# Altium schematic sheet Schematic_MC.SchDoc
size A2; SheetNumber: 1; SheetTotal: 1
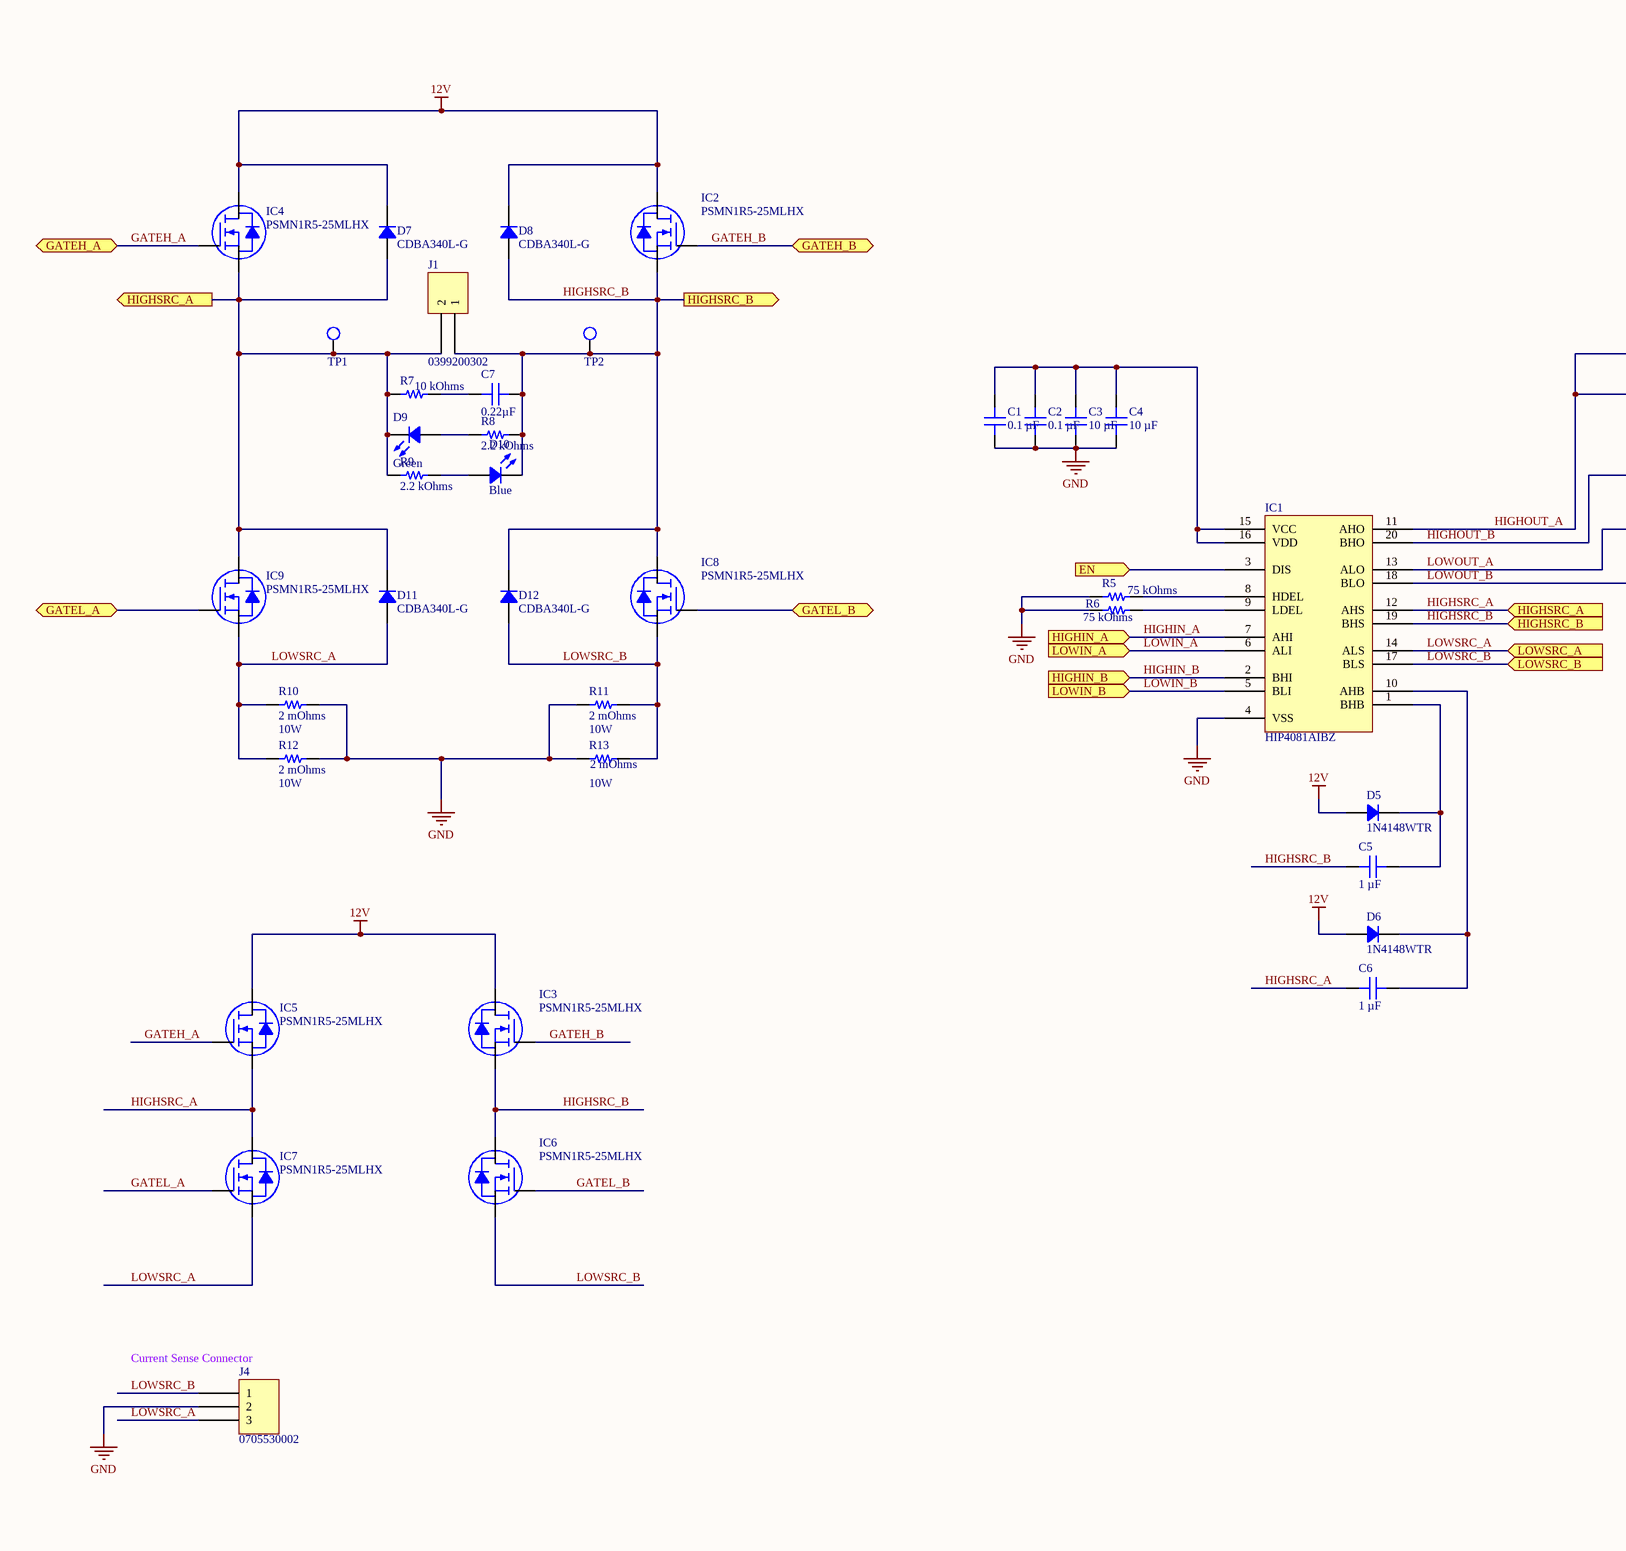
[diagram p0: Schematic_MC.SchDoc, left]
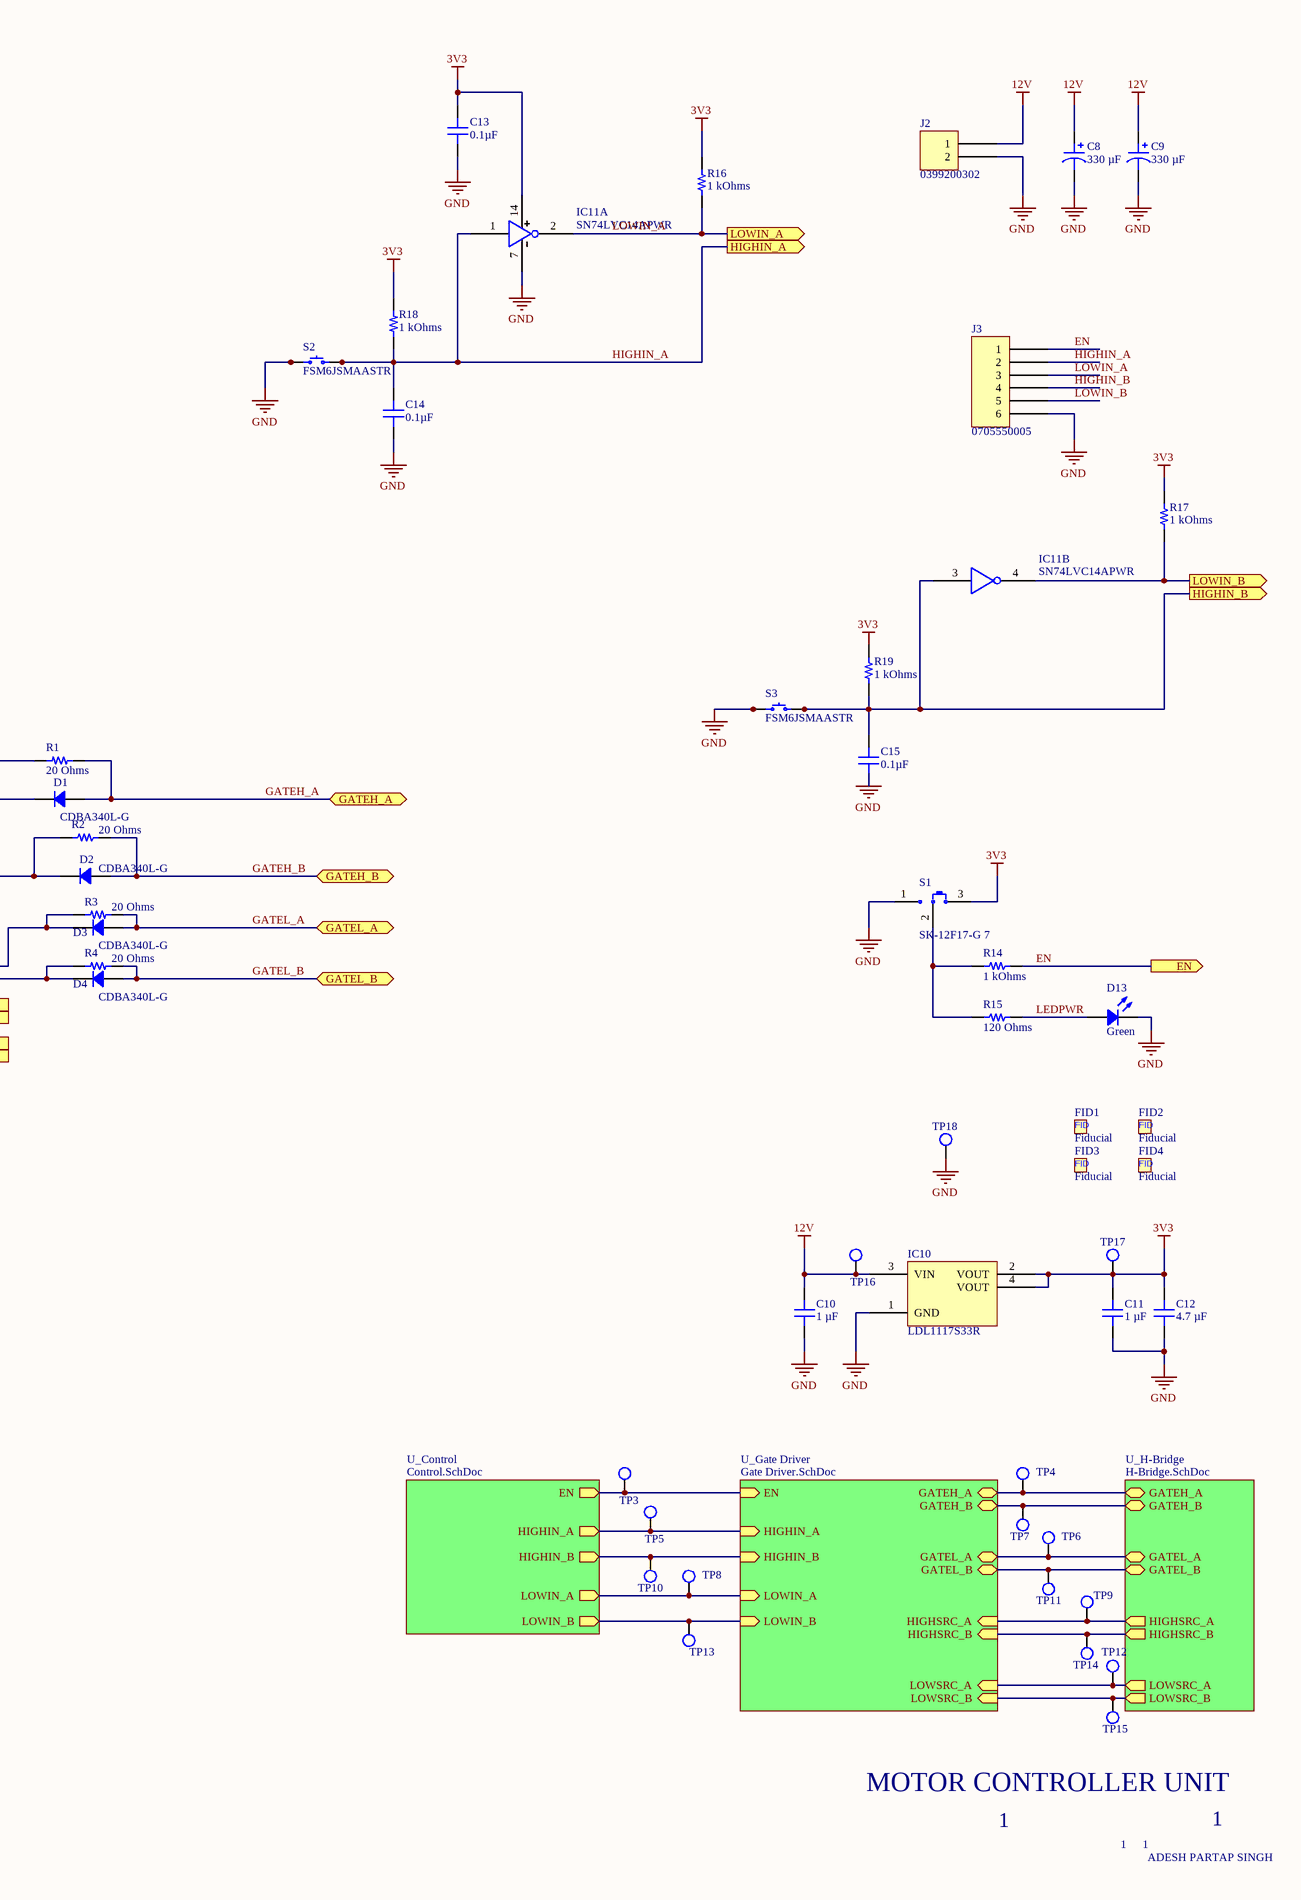
[diagram p1: Schematic_MC.SchDoc, right]

## Parts
C1  0.1 µF  [CAP 0603_1608]
C2  0.1 µF  [CAP 0603_1608]
C3  10 µF  [CAP 1206_3216 - 0.8MM]
C4  10 µF  [CAP 1206_3216 - 0.8MM]
C5  1 µF  [CAP 0805_2012]
C6  1 µF  [CAP 0805_2012]
C7  0.22µF  [CAP 0805_2012]
C8  330 µF  [CAP TH ALPOLY D10.00mm S5.00mm H13.50mm]
C9  330 µF  [CAP TH ALPOLY D10.00mm S5.00mm H13.50mm]
C10  1 µF  [CAP 0805_2012]
C11  1 µF  [CAP 0805_2012]
C12  4.7 µF  [CAP 0805_2012]
C13  0.1µF  [CAP 0603_1608]
C14  0.1µF  [CAP 0603_1608]
C15  0.1µF  [CAP 0603_1608]
D1  CDBA340L-G  [DO214AC SMA]
D2  CDBA340L-G  [DO214AC SMA]
D3  CDBA340L-G  [DO214AC SMA]
D4  CDBA340L-G  [DO214AC SMA]
D5  1N4148WTR  [SOD-123]
D6  1N4148WTR  [SOD-123]
D7  CDBA340L-G  [DO214AC SMA]
D8  CDBA340L-G  [DO214AC SMA]
D9  Green  [LED 0603_1608 GREEN]
D10  Blue  [LED 0603_1608 BLUE]
D11  CDBA340L-G  [DO214AC SMA]
D12  CDBA340L-G  [DO214AC SMA]
D13  Green  [LED 0603_1608 GREEN]
FID1  Fiducial  [Fiducial-1mm]
FID2  Fiducial  [Fiducial-1mm]
FID3  Fiducial  [Fiducial-1mm]
FID4  Fiducial  [Fiducial-1mm]
IC1  HIP4081AIBZ  [INTERSIL SOIC-20 WIDE]
IC2  PSMN1R5-25MLHX  [NEXPERIA LFPAK33 SOT1210]
IC3  PSMN1R5-25MLHX  [NEXPERIA LFPAK33 SOT1210]
IC4  PSMN1R5-25MLHX  [NEXPERIA LFPAK33 SOT1210]
IC5  PSMN1R5-25MLHX  [NEXPERIA LFPAK33 SOT1210]
IC6  PSMN1R5-25MLHX  [NEXPERIA LFPAK33 SOT1210]
IC7  PSMN1R5-25MLHX  [NEXPERIA LFPAK33 SOT1210]
IC8  PSMN1R5-25MLHX  [NEXPERIA LFPAK33 SOT1210]
IC9  PSMN1R5-25MLHX  [NEXPERIA LFPAK33 SOT1210]
IC10  LDL1117S33R  [ST SOT-223]
IC11  SN74LVC14APWR  [TI TSSOP-14 PW]  (parts A,B of 6)
J1  0399200302  [MOLEX 0399200302]
J2  0399200302  [MOLEX 0399200302]
J3  0705550005  [MOLEX SDA-70555-6PIN]
J4  0705530002  [MOLEX SDA-70553-3PIN]
R1  20 Ohms  [RES 0805_2012]
R2  20 Ohms  [RES 0805_2012]
R3  20 Ohms  [RES 0805_2012]
R4  20 Ohms  [RES 0805_2012]
R5  75 kOhms  [RES 0603_1608]
R6  75 kOhms  [RES 0603_1608]
R7  10 kOhms  [RES 0805_2012]
R8  2.2 kOhms  [RES 0603_1608]
R9  2.2 kOhms  [RES 0603_1608]
R10  2 mOhms  Power (Watts): 10W  [VISHAY WSHP2818]
R11  2 mOhms  Power (Watts): 10W  [VISHAY WSHP2818]
R12  2 mOhms  Power (Watts): 10W  [VISHAY WSHP2818]
R13  2 mOhms  Power (Watts): 10W  [VISHAY WSHP2818]
R14  1 kOhms  [RES 0603_1608]
R15  120 Ohms  [RES 0603_1608]
R16  1 kOhms  [RES 0603_1608]
R17  1 kOhms  [RES 0603_1608]
R18  1 kOhms  [RES 0603_1608]
R19  1 kOhms  [RES 0603_1608]
S1  SK-12F17-G 7  [C&K SK-12F17-G 7]
S2  FSM6JSMAASTR  [TE FSM6JSMA]
S3  FSM6JSMAASTR  [TE FSM6JSMA]
TP1  Test Point  [TestPoint-1.5mm]  (value not drawn)  (no BOM)
TP2  Test Point  [TestPoint-1.5mm]  (value not drawn)  (no BOM)
TP3  Test Point  [TestPoint-1.5mm]  (value not drawn)  (no BOM)
TP4  Test Point  [TestPoint-1.5mm]  (value not drawn)  (no BOM)
TP5  Test Point  [TestPoint-1.5mm]  (value not drawn)  (no BOM)
TP6  Test Point  [TestPoint-1.5mm]  (value not drawn)  (no BOM)
TP7  Test Point  [TestPoint-1.5mm]  (value not drawn)  (no BOM)
TP8  Test Point  [TestPoint-1.5mm]  (value not drawn)  (no BOM)
TP9  Test Point  [TestPoint-1.5mm]  (value not drawn)  (no BOM)
TP10  Test Point  [TestPoint-1.5mm]  (value not drawn)  (no BOM)
TP11  Test Point  [TestPoint-1.5mm]  (value not drawn)  (no BOM)
TP12  Test Point  [TestPoint-1.5mm]  (value not drawn)  (no BOM)
TP13  Test Point  [TestPoint-1.5mm]  (value not drawn)  (no BOM)
TP14  Test Point  [TestPoint-1.5mm]  (value not drawn)  (no BOM)
TP15  Test Point  [TestPoint-1.5mm]  (value not drawn)  (no BOM)
TP16  Test Point  [TestPoint-1.5mm]  (value not drawn)  (no BOM)
TP17  Test Point  [TestPoint-1.5mm]  (value not drawn)  (no BOM)
TP18  Test Point  [TestPoint-1.5mm]  (value not drawn)  (no BOM)

## Sub-sheets
U_Control = Control.SchDoc: HIGHIN_A (out), LOWIN_A (out), LOWIN_B (out), HIGHIN_B (out), EN (out)
U_Gate Driver = Gate Driver.SchDoc: HIGHIN_A (in), LOWIN_A (in), LOWIN_B (in), HIGHIN_B (in), HIGHSRC_A (in), HIGHSRC_B (in), LOWSRC_A (in), LOWSRC_B (in), GATEH_A (bidir), GATEH_B (bidir), GATEL_B (bidir), GATEL_A (bidir), EN (in)
U_H-Bridge = H-Bridge.SchDoc: HIGHSRC_A (out), HIGHSRC_B (out), LOWSRC_A (out), LOWSRC_B (out), GATEH_A (bidir), GATEH_B (bidir), GATEL_B (bidir), GATEL_A (bidir)

## Ports
EN (in), EN (out), GATEH_A (bidir), GATEH_B (bidir), GATEL_A (bidir), GATEL_B (bidir), HIGHIN_A (in), HIGHIN_A (out), HIGHIN_B (in), HIGHIN_B (out), HIGHSRC_A (in), HIGHSRC_A (out), HIGHSRC_B (in), HIGHSRC_B (out), LOWIN_A (in), LOWIN_A (out), LOWIN_B (in), LOWIN_B (out), LOWSRC_A (in), LOWSRC_B (in)

## Nets
3V3: C11.2 C12.2 C13.2 IC10.2(VOUT) IC10.4(VOUT) IC11.14(VCC) R16.2 R17.2 R18.2 R19.2 S1.3 TP17.1(TP)
12V: C8.1 C9.1 C10.2 D5.1 D6.1 D7.2 D8.2 IC2.D IC3.D IC4.D IC5.D IC10.3(VIN) J2.1 TP16.1(TP)
GND: C1.1 C2.1 C3.1 C4.1 C8.2 C9.2 C10.1 C11.1 C12.1 C13.1 C14.1 C15.1 D13.2 IC1.4(VSS) IC10.1(GND) IC11.7(GND) J2.2 J3.6 J4.2 R5.1 R6.1 R10.2 R11.1 R12.2 R13.1 S1.1 S2.1 S2.2 S3.1 S3.2 TP18.1(TP)
EN: IC1.3(DIS) J3.1 R14.2 ; port EN
GATEH_A: D1.1 IC4.G IC5.G R1.2 ; port GATEH_A
GATEH_B: D2.1 IC2.G IC3.G R2.2 ; port GATEH_B
GATEL_A: D3.1 IC7.G IC9.G R3.2 ; port GATEL_A
GATEL_B: D4.1 IC6.G IC8.G R4.2 ; port GATEL_B
HIGHIN_A: C14.2 IC1.7(AHI) IC11.1(1A) J3.2 R18.1 S2.3 S2.4 ; port HIGHIN_A
HIGHIN_B: C15.2 IC1.2(BHI) IC11.3(2A) J3.4 R19.1 S3.3 S3.4 ; port HIGHIN_B
HIGHOUT_A: D1.2 IC1.11(AHO) R1.1
HIGHOUT_B: D2.2 IC1.20(BHO) R2.1
HIGHSRC_A: C6.1 D7.1 D9.2 D11.2 IC1.12(AHS) IC4.S IC5.S IC7.D IC9.D J1.2 R7.1 R9.1 TP1.1(TP) ; port HIGHSRC_A
HIGHSRC_B: C5.1 C7.2 D8.1 D10.2 D12.2 IC1.19(BHS) IC2.S IC3.S IC6.D IC8.D J1.1 R8.2 TP2.1(TP) ; port HIGHSRC_B
LEDPWR: D13.1 R15.2
LOWIN_A: IC1.6(ALI) IC11.2(1Y) J3.3 R16.1 ; port LOWIN_A
LOWIN_B: IC1.5(BLI) IC11.4(2Y) J3.5 R17.1 ; port LOWIN_B
LOWOUT_A: D3.2 IC1.13(ALO) R3.1
LOWOUT_B: D4.2 IC1.18(BLO) R4.1
LOWSRC_A: D11.1 IC1.14(ALS) IC7.S IC9.S J4.3 R10.1 R12.1 ; port LOWSRC_A
LOWSRC_B: D12.1 IC1.17(BLS) IC6.S IC8.S J4.1 R11.2 R13.2 ; port LOWSRC_B
NetC1_2: C1.2 C2.2 C3.2 C4.2 IC1.15(VCC) IC1.16(VDD)
NetC5_2: C5.2 D5.2 IC1.1(BHB)
NetC6_2: C6.2 D6.2 IC1.10(AHB)
NetC7_1: C7.1 R7.2
NetD9_1: D9.1 R8.1
NetD10_1: D10.1 R9.2
NetIC1_8: IC1.8(HDEL) R5.2
NetIC1_9: IC1.9(LDEL) R6.2
NetR14_1: R14.1 R15.1 S1.2(COM)
NetTP3_1: TP3.1(TP) ; sheet U_Gate Driver/EN, sheet U_Control/EN
NetTP4_1: TP4.1(TP) ; sheet U_Gate Driver/GATEH_A, sheet U_H-Bridge/GATEH_A
NetTP5_1: TP5.1(TP) ; sheet U_Gate Driver/HIGHIN_A, sheet U_Control/HIGHIN_A
NetTP6_1: TP6.1(TP) ; sheet U_Gate Driver/GATEL_A, sheet U_H-Bridge/GATEL_A
NetTP7_1: TP7.1(TP) ; sheet U_Gate Driver/GATEH_B, sheet U_H-Bridge/GATEH_B
NetTP8_1: TP8.1(TP) ; sheet U_Gate Driver/LOWIN_A, sheet U_Control/LOWIN_A
NetTP9_1: TP9.1(TP) ; sheet U_Gate Driver/HIGHSRC_A, sheet U_H-Bridge/HIGHSRC_A
NetTP10_1: TP10.1(TP) ; sheet U_Gate Driver/HIGHIN_B, sheet U_Control/HIGHIN_B
NetTP11_1: TP11.1(TP) ; sheet U_Gate Driver/GATEL_B, sheet U_H-Bridge/GATEL_B
NetTP12_1: TP12.1(TP) ; sheet U_Gate Driver/LOWSRC_A, sheet U_H-Bridge/LOWSRC_A
NetTP13_1: TP13.1(TP) ; sheet U_Gate Driver/LOWIN_B, sheet U_Control/LOWIN_B
NetTP14_1: TP14.1(TP) ; sheet U_Gate Driver/HIGHSRC_B, sheet U_H-Bridge/HIGHSRC_B
NetTP15_1: TP15.1(TP) ; sheet U_Gate Driver/LOWSRC_B, sheet U_H-Bridge/LOWSRC_B

## Notes on the sheet
- (near J4) Current Sense Connector
- MOTOR CONTROLLER UNIT
- 1
- ADESH PARTAP SINGH
- (in symbol Fiducial) FID

## Library data of the parts
C1 C2 = C0603C104K8RAC7867: CAP CER 0.1UF 10V X7R 0603; manufacturer: KEMET; Tolerance: ±10%; Part Number: C0603C104K8RAC7867; Value: 0.1 µF; Applications: Bypass, Decoupling; Capacitance: 0.1 µF; componentlink1description: Datasheet; componentlink1url: https://api.kemet.com/component-edge/download/datasheet/C0603C104K8RACTU.pdf; componentlink2description: DigiKey Link; componentlink2url: https://www.digikey.com/en/products/detail/kemet/C0603C104K8RAC7867/411094; Device Package: 0603 (1608 Metric); lastupdated: 05/03/2022 16:47:38; Lifecycle Status: Active; Minimum Order: 1; Mounting Type: Surface Mount, MLCC; Operating Temperature: -55°C ~ 125°C; Package / Case: 0603 (1608 Metric); packaging: TapeAndReel; partid: 35650; Part Status: Active; price: 0.01; series: SMD Comm X7R; Size / Dimension: 0.063" L x 0.031" W (1.60mm x 0.80mm); Supplier 1: DigiKey; Supplier Part Number 1: 399-C0603C104K8RAC7867CT-ND; Temperature Coefficient: X7R; Thickness (Max): 0.034" (0.87mm); Voltage - Rated: 10V
C3 C4 = GRT31CR61H106ME01L: CAP CER 10UF 50V X5R 1206; manufacturer: Murata Electronics; Tolerance: ±20%; Part Number: GRT31CR61H106ME01L; Value: 10 µF; Applications: Automotive; Capacitance: 10 µF; componentlink1description: Datasheet; componentlink1url: https://search.murata.co.jp/Ceramy/image/img/A01X/G101/ENG/GRT31CR61H106ME01-01.pdf; componentlink2description: DigiKey Link; componentlink2url: https://www.digikey.com/en/products/detail/murata-electronics/GRT31CR61H106ME01L/5416879; Device Package: 1206 (3216 Metric); lastupdated: 04/03/2022 17:33:28; Lifecycle Status: Active; Minimum Order: 1; Mounting Type: Surface Mount, MLCC; Operating Temperature: -55°C ~ 85°C; Package / Case: 1206 (3216 Metric); packaging: TapeAndReel; partid: 22693; Part Status: Active; price: 0.09; Ratings: AEC-Q200; series: GRT; Size / Dimension: 0.126" L x 0.063" W (3.20mm x 1.60mm); Supplier 1: DigiKey; Supplier Part Number 1: 490-12457-1-ND; Temperature Coefficient: X5R; Thickness (Max): 0.071" (1.80mm); Voltage - Rated: 50V
C5 C6 C10 C11 = 08055C105KAZ2A: CAP CER 1UF 50V X7R 0805; manufacturer: KYOCERA AVX; Tolerance: ±10%; Part Number: 08055C105KAZ2A; Value: 1 µF; Applications: Boardflex Sensitive; Capacitance: 1 µF; componentlink1description: Datasheet; componentlink1url: https://datasheets.kyocera-avx.com/FlexitermMLCC.pdf; componentlink2description: DigiKey Link; componentlink2url: https://www.digikey.com/en/products/detail/kyocera-avx/08055C105KAZ2A/11568641; Device Package: 0805 (2012 Metric); Features: Soft Termination; lastupdated: 05/03/2022 16:50:45; Lifecycle Status: Active; Minimum Order: 1; Mounting Type: Surface Mount, MLCC; Operating Temperature: -55°C ~ 125°C; Package / Case: 0805 (2012 Metric); packaging: TapeAndReel; partid: 33480; Part Status: Active; price: 0.06; series: -; Size / Dimension: 0.079" L x 0.049" W (2.01mm x 1.25mm); Supplier 1: DigiKey; Supplier Part Number 1: 478-08055C105KAZ2ACT-ND; Temperature Coefficient: X7R; Thickness (Max): 0.055" (1.40mm); Voltage - Rated: 50V
C7 = 08055C224KAZ2A: CAP CER 0.22UF 50V X7R 0805; manufacturer: AVX Corporation; Tolerance: ±10%; Part Number: 08055C224KAZ2A; Value: 0.22µF; Applications: Boardflex Sensitive; Capacitance: 0.22µF; componentlink1description: Datasheet; componentlink1url: http://datasheets.avx.com/FlexitermMLCC.pdf; componentlink2description: DigiKey Link; componentlink2url: http://digikey.com/product-detail/en/avx-corporation/08055C224KAZ2A/478-3555-1-ND/1024908; Device Package: 0805 (2012 Metric); Features: Soft Termination; lastupdated: 02/09/2020 01:04:11; Lifecycle Status: Active; Minimum Order: 1; Mounting Type: Surface Mount, MLCC; Operating Temperature: -55°C ~ 125°C; Package / Case: 0805 (2012 Metric); packaging: TapeAndReel; partid: 16770; Part Status: Active; price: 0.07; series: FLEXITERM®; Size / Dimension: 0.079" L x 0.049" W (2.01mm x 1.25mm); Supplier 1: DigiKey; Supplier Part Number 1: 478-3555-1-ND; Temperature Coefficient: X7R; Thickness (Max): 0.055" (1.40mm); Voltage - Rated: 50V
C8 C9 = 337AVG035MGBJ: CAP ALUM POLY 330UF 20% 35V T/H; manufacturer: Illinois Capacitor; ESR (Equivalent Series Resistance): 24mOhm; Lifetime @ Temp.: 1500 Hrs @ 125°C; Ripple Current @ High Frequency: 3.4 A @ 100 kHz; Ripple Current @ Low Frequency: 170 mA @ 120 Hz; Type: Polymer; Part Number: 337AVG035MGBJ; Value: 330 µF; Applications: General Purpose; Capacitance: 330 µF; componentlink1description: Datasheet; componentlink1url: http://www.illinoiscapacitor.com/pdf/seriesDocuments/AVG%20series.pdf; componentlink2description: DigiKey Link; componentlink2url: https://www.digikey.com/en/products/detail/illinois-capacitor/337AVG035MGBJ/5412303; Device Package: Radial, Can; Height - Seated (Max): 0.532" (13.50mm); lastupdated: 05/03/2022 17:42:14; Lead Spacing: 0.197" (5.00mm); Lifecycle Status: Active; Minimum Order: 1; Mounting Type: Through Hole; Operating Temperature: -55°C ~ 125°C; Package / Case: Radial, Can; packaging: Bulk; partid: 4548; Part Status: Active; price: 1.51; series: AVG; Size / Dimension: 0.394" Dia (10.00mm); Supplier 1: DigiKey; Supplier Part Number 1: 1572-1435-ND; Tolerance: ±20%; Voltage - Rated: 35 V
C12 = 885012107009: CAP CER 4.7UF 10V X5R 0805; manufacturer: Würth Elektronik; Tolerance: ±20%; Part Number: 885012107009; Value: 4.7 µF; Applications: General Purpose; Capacitance: 4.7 µF; componentlink1description: Datasheet; componentlink1url: https://katalog.we-online.de/pbs/datasheet/885012107009.pdf; componentlink2description: DigiKey Link; componentlink2url: https://www.digikey.com/en/products/detail/würth-elektronik/885012107009/5453474; Device Package: 0805 (2012 Metric); lastupdated: 05/03/2022 16:51:07; Lifecycle Status: Active; Minimum Order: 1; Mounting Type: Surface Mount, MLCC; Operating Temperature: -55°C ~ 85°C; Package / Case: 0805 (2012 Metric); packaging: TapeAndReel; partid: 14493; Part Status: Active; price: 0.09; series: WCAP-CSGP; Size / Dimension: 0.079" L x 0.049" W (2.00mm x 1.25mm); Supplier 1: DigiKey; Supplier Part Number 1: 732-7619-1-ND; Temperature Coefficient: X5R; Thickness (Max): 0.053" (1.35mm); Voltage - Rated: 10V
C13-C15 = 06035C104MAT2A: CAP CER 0.1UF 50V X7R 0603; manufacturer: AVX Corporation; Tolerance: ±20%; Part Number: 06035C104MAT2A; Value: 0.1µF; Applications: General Purpose; Capacitance: 0.1µF; componentlink1description: Datasheet; componentlink1url: http://datasheets.avx.com/X7RDielectric.pdf; componentlink2description: DigiKey Link; componentlink2url: http://digikey.com/product-detail/en/avx-corporation/06035C104MAT2A/478-7928-1-ND/3881551; Device Package: 0603 (1608 Metric); lastupdated: 02/09/2020 01:03:35; Lifecycle Status: Active; Minimum Order: 1; Mounting Type: Surface Mount, MLCC; Operating Temperature: -55°C ~ 125°C; Package / Case: 0603 (1608 Metric); packaging: TapeAndReel; partid: 2734; Part Status: Active; price: 0.02; series: -; Size / Dimension: 0.063" L x 0.032" W (1.60mm x 0.81mm); Supplier 1: DigiKey; Supplier Part Number 1: 478-7928-1-ND; Temperature Coefficient: X7R; Thickness (Max): 0.035" (0.90mm); Voltage - Rated: 50V
D1-D4 D7 D8 D11 D12 = CDBA340L-G: DIODE SCHOTTKY 40V 3A DO214AC; Manufacturer: Comchip Technology; Current - Reverse Leakage @ Vr: 1.5 mA @ 40 V; Speed: Fast Recovery =< 500ns, > 200mA (Io); Voltage - Forward (Vf) (Max) @ If: 400 mV @ 3 A; Part Number: CDBA340L-G; ComponentLink1Description: Datasheet; ComponentLink1URL: http://www.comchiptech.com/admin/files/product/CDBA340L-HF%20RevC514368.pdf; ComponentLink2Description: DigiKey Link; ComponentLink2URL: https://www.digikey.com/en/products/detail/comchip-technology/CDBA340L-G/1249117; Current - Average Rectified (Io): 3A; Diode Type: Schottky; LastUpdated: 04/03/2022 18:07:12; Lifecycle Status: Active; Minimum Order: 1; Mounting Type: Surface Mount; Operating Temperature - Junction: 125°C (Max); Package / Case: DO-214AC, SMA; Packaging: TapeAndReel; PartId: 2091; Part Status: Active; Price: 0.20; Series: -; Supplier 1: DigiKey; Supplier Part Number 1: 641-1258-1-ND; Supplier Device Package: DO-214AC (SMA); Voltage - DC Reverse (Vr) (Max): 40 V
D5 D6 = 1N4148WTR: DIODE GEN PURP 75V 250MA SOD123; Manufacturer: SMC Diode Solutions; Capacitance @ Vr, F: 4pF @ 0V, 1MHz; Current - Average Rectified (Io): 250mA (DC); Current - Reverse Leakage @ Vr: 2.5 µA @ 75 V; Diode Type: Standard; Reverse Recovery Time (trr): 4 ns; Speed: Fast Recovery =< 500ns, > 200mA (Io); Voltage - Forward (Vf) (Max) @ If: 1.25 V @ 150 mA; Part Number: 1N4148WTR; ComponentLink1Description: Datasheet; ComponentLink1URL: http://www.smc-diodes.com/propdf/1N4148W%20N0571%20REV.D.pdf; ComponentLink2Description: DigiKey Link; ComponentLink2URL: https://www.digikey.com/en/products/detail/smc-diode-solutions/1N4148WTR/6022450; LastUpdated: 04/03/2022 18:07:21; Lifecycle Status: Active; Minimum Order: 1; Mounting Type: Surface Mount; Operating Temperature - Junction: -55°C ~ 150°C; Package / Case: SOD-123; Packaging: TapeAndReel; PartId: 1049; Part Status: Active; Price: 0.02; Series: -; Supplier 1: DigiKey; Supplier Part Number 1: 1655-1360-1-ND; Supplier Device Package: SOD-123; Voltage - DC Reverse (Vr) (Max): 75 V
D9 D13 = XZMG53W-1: LED GREEN CLEAR CHIP SMD; Manufacturer: SunLED; Configuration: Standard; Current - Test: 20mA; Lens Color: Colorless; Lens Size: 1.10mm x 0.80mm; Lens Style: Rectangle with Flat Top; Millicandela Rating: 11mcd; Viewing Angle: 120°; Voltage - Forward (Vf) (Typ): 2.2V; Wavelength - Dominant: 568nm; Wavelength - Peak: 565nm; Part Number: XZMG53W-1; Color: Green; ComponentLink1Description: Datasheet; ComponentLink1URL: https://www.sunledusa.com/products/spec/XZMG53W-1.pdf; ComponentLink2Description: DigiKey Link; ComponentLink2URL: https://www.digikey.com/en/products/detail/sunled/XZMG53W-1/4745960; Device Package: 0603 (1608 Metric); Height (Max): 0.75mm; LastUpdated: 04/03/2022 18:10:12; Lens Transparency: Clear; Lifecycle Status: Active; Minimum Order: 1; Mounting Type: Surface Mount; Package / Case: 0603 (1608 Metric); Packaging: TapeAndReel; PartId: 678; Part Status: Active; Price: 0.04; Series: -; Size / Dimension: 1.60mm L x 0.80mm W; Supplier 1: DigiKey; Supplier Part Number 1: 1497-1186-1-ND; Supplier Device Package: Chip LED; Value: Green
D10 = 19-213SUBC/S400-A5/S208-2/TR8: LED BLUE CLEAR 2SMD; Manufacturer: Everlight Electronics Co Ltd; Configuration: Standard; Current - Test: 5mA; Lens Color: Colorless; Lens Size: 1.20mm x 0.80mm; Lens Style: Rectangle with Flat Top; Viewing Angle: 120°; Voltage - Forward (Vf) (Typ): 2.9V; Wavelength - Peak: 468nm; Part Number: 19-213SUBC/S400-A5/S208-2/TR8; Color: Blue; ComponentLink1Description: Datasheet; ComponentLink1URL: //media.digikey.com/pdf/Data%20Sheets/Everlight%20PDFs/19-213SUBC-S400-A5-S208-2-TR8.pdf; ComponentLink2Description: DigiKey Link; ComponentLink2URL: https://www.digikey.com/en/products/detail/everlight-electronics-co-ltd/19-213SUBC-S400-A5-S208-2-TR8/8535275; Device Package: 0603 (1608 Metric); Height (Max): 0.70mm; LastUpdated: 04/03/2022 18:09:56; Lens Transparency: Clear; Lifecycle Status: Active; Minimum Order: 1; Mounting Type: Surface Mount; Package / Case: 0603 (1608 Metric); Packaging: TapeAndReel; PartId: 808; Part Status: Active; Price: 0.04; Series: -; Size / Dimension: 1.60mm L x 0.80mm W; Supplier 1: DigiKey; Supplier Part Number 1: 1080-1581-1-ND; Supplier Device Package: 2-SMD; Value: Blue
IC1 = HIP4081AIBZ: IC GATE DRVR HALF-BRIDGE 20SOIC; Manufacturer: Renesas Electronics America Inc.; Channel Type: Independent; Current - Peak Output (Source, Sink): 2.6A, 2.4A; Gate Type: N-Channel MOSFET; High Side Voltage - Max (Bootstrap): 95V; Input Type: Non-Inverting; Logic Voltage - VIL, VIH: 1V, 2.5V; Number of Drivers: 4; Rise / Fall Time (Typ): 10ns, 10ns; Voltage - Supply: 9.5V ~ 15V; Part Number: HIP4081AIBZ; ComponentLink1Description: Datasheet; ComponentLink1URL: https://www.renesas.com/en-us/www/doc/datasheet/hip4081a.pdf; ComponentLink2Description: DigiKey Link; ComponentLink2URL: //digikey.com/product-detail/en/renesas-electronics-america-inc/HIP4081AIBZ/HIP4081AIBZ-ND/821444; Device Package: 20-SOIC (0.295", 7.50mm Width); Driven Configuration: Half-Bridge; LastUpdated: 12/12/2019 08:03:43; Lifecycle Status: 0; Minimum Order: 1; Mounting Type: Surface Mount; Operating Temperature: -40°C ~ 125°C (TJ); Package / Case: 20-SOIC (0.295", 7.50mm Width); Packaging: Tube; PartId: 4; Part Status: Active; Price: 5.41; Series: -; Supplier 1: DigiKey; Supplier Part Number 1: HIP4081AIBZ-ND; Supplier Device Package: 20-SOIC
IC2-IC9 = PSMN1R5-25MLHX: MOSFET N-CH 25V 150A LFPAK33; Manufacturer: Nexperia USA Inc.; Current - Continuous Drain (Id) @ 25°C: 150A (Ta); Drive Voltage (Max Rds On,  Min Rds On): 4.5V, 10V; FET Type: N-Channel; Gate Charge (Qg) (Max) @ Vgs: 58 nC @ 10 V; Input Capacitance (Ciss) (Max) @ Vds: 3167 pF @ 12 V; Power Dissipation (Max): 106W (Ta); Rds On (Max) @ Id, Vgs: 1.81mOhm @ 25A, 10V; Vgs (Max): ±20V; Vgs(th) (Max) @ Id: 2.2V @ 1mA; Part Number: PSMN1R5-25MLHX; ComponentLink1Description: Datasheet; ComponentLink1URL: https://assets.nexperia.com/documents/data-sheet/PSMN1R5-25MLH.pdf; ComponentLink2Description: DigiKey Link; ComponentLink2URL: https://www.digikey.com/en/products/detail/nexperia-usa-inc/PSMN1R5-25MLHX/11205917; Device Package: 1210 (3225 Metric); Drain to Source Voltage (Vdss): 25 V; LastUpdated: 05/03/2022 14:14:29; Lifecycle Status: Active; Minimum Order: 1; Mounting Type: Surface Mount; Operating Temperature: -55°C ~ 175°C (TJ); Package / Case: 1210 (3225 Metric); Packaging: TapeAndReel; Part Status: Active; Price: 0.82; Series: -; Supplier 1: DigiKey; Supplier Part Number 1: 1727-PSMN1R5-25MLHXCT-ND; Supplier Device Package: LFPAK33; Technology: MOSFET (Metal Oxide)
IC10 = LDL1117S33R: IC REG LINEAR 3.3V 1.2A SOT223; Manufacturer: STMicroelectronics; Current - Quiescent (Iq): 500 µA; Number of Regulators: 1; Output Configuration: Positive; Output Type: Fixed; Protection Features: Over Current, Over Temperature, Under Voltage Lockout (UVLO); PSRR: 87dB ~ 65dB (120Hz ~ 100kHz); Voltage Dropout (Max): 0.6V @ 1.2A; Voltage - Input (Max): 18V; Part Number: LDL1117S33R; ComponentLink1Description: Datasheet; ComponentLink1URL: http://www.st.com/content/ccc/resource/technical/document/datasheet/group3/0e/5a/00/ca/10/1a/4f/a5/DM00366442/files/DM00366442.pdf/jcr:content/translations/en.DM00366442.pdf; ComponentLink2Description: DigiKey Link; ComponentLink2URL: https://www.digikey.com/en/products/detail/stmicroelectronics/LDL1117S33R/7102071; Current - Output: 1.2A; LastUpdated: 05/03/2022 21:27:25; Lifecycle Status: Active; Minimum Order: 1; Mounting Type: Surface Mount; Operating Temperature: -40°C ~ 125°C (TJ); Package / Case: TO-261-4, TO-261AA; Packaging: TapeAndReel; Part Status: Active; Price: 0.14; Series: -; Supplier 1: DigiKey; Supplier Part Number 1: 497-17239-1-ND; Supplier Device Package: SOT-223; Voltage - Output (Min/Fixed): 3.3V
IC11 = SN74LVC14APWR: IC INVERTER 6CH 6-INP 14TSSOP; Manufacturer: Texas Instruments; Current - Output High, Low: 24mA, 24mA; Current - Quiescent (Max): 1 µA; Logic Level - High: 1.3V ~ 2V; Logic Level - Low: 0.15V ~ 0.8V; Max Propagation Delay @ V, Max CL: 6.2ns @ 3.3V, 50pF; Number of Circuits: 6; Voltage - Supply: 1.65V ~ 3.6V; Part Number: SN74LVC14APWR; ComponentLink1Description: Datasheet; ComponentLink1URL: http://www.ti.com/general/docs/suppproductinfo.tsp?distId=10&gotoUrl=http%3A%2F%2Fwww.ti.com%2Flit%2Fgpn%2Fsn74lvc14a; ComponentLink2Description: DigiKey Link; ComponentLink2URL: https://www.digikey.com/en/products/detail/texas-instruments/SN74LVC14APWR/276867; Features: Schmitt Trigger; LastUpdated: 05/03/2022 19:21:42; Lifecycle Status: Active; Logic Type: Inverter; Minimum Order: 1; Mounting Type: Surface Mount; Number of Inputs: 6; Operating Temperature: -40°C ~ 125°C; Package / Case: 14-TSSOP (0.173", 4.40mm Width); Packaging: TapeAndReel; PartId: 14; Part Status: Active; Price: 0.11; Series: 74LVC; Supplier 1: DigiKey; Supplier Part Number 1: 296-1224-1-ND; Supplier Device Package: 14-TSSOP
J1 J2 = 0399200302: TERM BLK 2P SIDE ENTRY 15MM PCB; Manufacturer: Molex; Current: 115 A; Mating Orientation: Horizontal with Board; Number of Levels: 1; Pitch: 0.591" (15.00mm); Positions Per Level: 2; Voltage: 600 V; Wire Gauge: 1-8 AWG; Wire Termination: Screw - Rising Cage Clamp; Part Number: 0399200302; Color: Black; ComponentLink1Description: Datasheet; ComponentLink1URL: https://www.molex.com/pdm_docs/sd/399200302_sd.pdf; ComponentLink2Description: DigiKey Link; ComponentLink2URL: https://www.digikey.com/en/products/detail/molex/0399200302/3316297; LastUpdated: 05/03/2022 16:30:55; Lifecycle Status: Active; Minimum Order: 1; Mounting Type: Through Hole; Packaging: Bulk; Part Status: Active; Price: 5.90; Series: Eurostyle 39920; Supplier 1: DigiKey; Supplier Part Number 1: WM20114-ND
J3 = 0705550005: CONN HEADER R/A 6POS 2.54MM; Manufacturer: Molex; Contact Length - Mating: 0.240" (6.10mm); Contact Length - Post: 0.130" (3.30mm); Material Flammability Rating: UL94 V-0; Number of Positions: 6; Number of Positions Loaded: All; Pitch - Mating: 0.100" (2.54mm); Shrouding: Shrouded - 4 Wall; Style: Board to Cable/Wire; Voltage Rating: 250V; Part Number: 0705550005; ComponentLink1Description: Datasheet; ComponentLink1URL: https://www.molex.com/pdm_docs/sd/705550001_sd.pdf; ComponentLink2Description: DigiKey Link; ComponentLink2URL: http://digikey.com/product-detail/en/molex/0705550005/23-0705550005-ND/1643402; Connector Type: Header; Contact Finish - Mating: Tin; Contact Finish - Post: Tin; Contact Finish Thickness - Mating: 150.0µin (3.81µm); Contact Material: Phosphor Bronze; Contact Shape: Square; Contact Type: Male Pin; Fastening Type: Latch Holder; Features: Board Guide; Insulation Color: Black; Insulation Height: 0.215" (5.45mm); Insulation Material: Polyester, Glass Filled; LastUpdated: 13/01/2020 00:04:40; Lifecycle Status: Active; Minimum Order: 1; Mounting Type: Through Hole, Right Angle; Number of Rows: 1; Operating Temperature: -40°C ~ 105°C; Packaging: Tube; PartId: 102; Part Status: Active; Price: 1.19; Series: SL 70555; Supplier 1: DigiKey; Supplier Part Number 1: 23-0705550005-ND; Termination: Solder
J4 = 0705530002: CONN HEADER R/A 3POS 2.54MM; Manufacturer: Molex; Contact Length - Mating: 0.240" (6.10mm); Contact Length - Post: 0.130" (3.30mm); Material Flammability Rating: UL94 V-0; Number of Positions: 3; Number of Positions Loaded: All; Pitch - Mating: 0.100" (2.54mm); Shrouding: Shrouded - 4 Wall; Style: Board to Cable/Wire; Voltage Rating: 250V; Part Number: 0705530002; ComponentLink1Description: Datasheet; ComponentLink1URL: https://www.molex.com/pdm_docs/sd/705530002_sd.pdf; ComponentLink2Description: DigiKey Link; ComponentLink2URL: http://digikey.com/product-detail/en/molex/0705530002/WM4901-ND/114955; Connector Type: Header; Contact Finish - Mating: Gold; Contact Finish - Post: Tin; Contact Finish Thickness - Mating: 15.0µin (0.38µm); Contact Material: Phosphor Bronze; Contact Shape: Square; Contact Type: Male Pin; Fastening Type: Latch Holder; Insulation Color: Black; Insulation Height: 0.215" (5.45mm); Insulation Material: Polyester, Glass Filled; LastUpdated: 12/01/2020 23:55:56; Lifecycle Status: Active; Minimum Order: 1; Mounting Type: Through Hole, Right Angle; Number of Rows: 1; Operating Temperature: -40°C ~ 105°C; Packaging: Tube; PartId: 86; Part Status: Active; Price: 1.02; Series: SL 70553; Supplier 1: DigiKey; Supplier Part Number 1: WM4901-ND; Termination: Solder
R1-R4 = ERJ-6GEYJ200V: RES SMD 20 OHM 5% 1/8W 0805; Manufacturer: Panasonic Electronic Components; Power (Watts): 0.125W, 1/8W; Temperature Coefficient: ±200ppm/°C; Part Number: ERJ-6GEYJ200V; Value: 20 Ohms; ComponentLink1Description: Datasheet; ComponentLink1URL: http://industrial.panasonic.com/www-cgi/jvcr13pz.cgi?E+PZ+3+AOA0001+ERJ6GEYJ200V+7+WW; ComponentLink2Description: DigiKey Link; ComponentLink2URL: https://www.digikey.com/en/products/detail/panasonic-electronic-components/ERJ-6GEYJ200V/82980; Composition: Thick Film; Device Package: 0805 (2012 Metric); Features: Automotive AEC-Q200; Height - Seated (Max): 0.028" (0.70mm); LastUpdated: 05/03/2022 17:15:03; Lifecycle Status: Active; Minimum Order: 1; Number of Terminations: 2; Operating Temperature: -55°C ~ 155°C; Package / Case: 0805 (2012 Metric); Packaging: TapeAndReel; PartId: 47698; Part Status: Active; Price: 0.01; Ratings: AEC-Q200; Resistance: 20 Ohms; Series: ERJ-6G; Size / Dimension: 0.079" L x 0.049" W (2.00mm x 1.25mm); Supplier 1: DigiKey; Supplier Part Number 1: P20ACT-ND; Supplier Device Package: 0805; Tolerance: ±5%
R5 R6 = CRCW060375K0FKEAC: RES 75K OHM 1% 1/10W 0603; Manufacturer: Vishay Dale; Power (Watts): 0.1W, 1/10W; Temperature Coefficient: ±100ppm/°C; Part Number: CRCW060375K0FKEAC; Value: 75 kOhms; ComponentLink1Description: Datasheet; ComponentLink1URL: https://www.vishay.com/docs/28773/crcwce3.pdf; ComponentLink2Description: DigiKey Link; ComponentLink2URL: https://www.digikey.com/en/products/detail/vishay-dale/CRCW060375K0FKEAC/7924043; Composition: Thick Film; Device Package: 0603 (1608 Metric); Height - Seated (Max): 0.022" (0.55mm); LastUpdated: 04/03/2022 17:45:17; Lifecycle Status: Active; Minimum Order: 1; Number of Terminations: 2; Operating Temperature: -55°C ~ 155°C; Package / Case: 0603 (1608 Metric); Packaging: CutTape; PartId: 65787; Part Status: Active; Price: 0.01; Resistance: 75 kOhms; Series: CRCW-C; Size / Dimension: 0.063" L x 0.031" W (1.60mm x 0.80mm); Supplier 1: DigiKey; Supplier Part Number 1: 541-5552-1-ND; Supplier Device Package: 0603; Tolerance: ±1%
R7 = ERJ-P06J103V: RES SMD 10K OHM 5% 1/2W 0805; Manufacturer: Panasonic Electronic Components; Power (Watts): 0.5W, 1/2W; Temperature Coefficient: ±200ppm/°C; Part Number: ERJ-P06J103V; Value: 10 kOhms; ComponentLink1Description: Datasheet; ComponentLink1URL: https://industrial.panasonic.com/cdbs/www-data/pdf/RDO0000/AOA0000C331.pdf; ComponentLink2Description: DigiKey Link; ComponentLink2URL: https://www.digikey.com/en/products/detail/panasonic-electronic-components/ERJ-P06J103V/525198; Composition: Thick Film; Device Package: 0805 (2012 Metric); Features: Automotive AEC-Q200, Pulse Withstanding; Height - Seated (Max): 0.028" (0.70mm); LastUpdated: 04/03/2022 17:58:19; Lifecycle Status: Active; Minimum Order: 1; Number of Terminations: 2; Operating Temperature: -55°C ~ 155°C; Package / Case: 0805 (2012 Metric); Packaging: TapeAndReel; PartId: 48720; Part Status: Active; Price: 0.02; Ratings: AEC-Q200; Resistance: 10 kOhms; Series: ERJ-P06; Size / Dimension: 0.079" L x 0.049" W (2.00mm x 1.25mm); Supplier 1: DigiKey; Supplier Part Number 1: P10KADCT-ND; Supplier Device Package: 0805; Tolerance: ±5%
R8 R9 = ERJ-PA3J222V: RES SMD 2.2K OHM 5% 1/4W 0603; Manufacturer: Panasonic Electronic Components; Power (Watts): 0.25W, 1/4W; Temperature Coefficient: ±200ppm/°C; Part Number: ERJ-PA3J222V; Value: 2.2 kOhms; ComponentLink1Description: Datasheet; ComponentLink1URL: https://industrial.panasonic.com/cdbs/www-data/pdf/RDO0000/AOA0000C331.pdf; ComponentLink2Description: DigiKey Link; ComponentLink2URL: https://www.digikey.com/en/products/detail/panasonic-electronic-components/ERJ-PA3J222V/5036018; Composition: Thick Film; Device Package: 0603 (1608 Metric); Features: Automotive AEC-Q200, Pulse Withstanding; Height - Seated (Max): 0.022" (0.55mm); LastUpdated: 04/03/2022 17:46:44; Lifecycle Status: Active; Minimum Order: 1; Number of Terminations: 2; Operating Temperature: -55°C ~ 155°C; Package / Case: 0603 (1608 Metric); Packaging: TapeAndReel; PartId: 14127; Part Status: Active; Price: 0.01; Ratings: AEC-Q200; Resistance: 2.2 kOhms; Series: ERJ-PA3; Size / Dimension: 0.063" L x 0.031" W (1.60mm x 0.80mm); Supplier 1: DigiKey; Supplier Part Number 1: P2.2KBZCT-ND; Supplier Device Package: 0603; Tolerance: ±5%
R10-R13 = WSHP28182L000FEA: RES 0.002 OHM 1% 10W 2818; Manufacturer: Vishay Dale; Temperature Coefficient: ±200ppm/°C; Part Number: WSHP28182L000FEA; Package / Case: Nonstandard; ComponentLink1Description: Datasheet; ComponentLink1URL: http://www.vishay.com/docs/30347/wshp2818.pdf; ComponentLink2Description: DigiKey Link; ComponentLink2URL: http://digikey.com/product-detail/en/vishay-dale/WSHP28182L000FEA/541-3273-1-ND/6605249; Composition: Metal Element; Device Package: Nonstandard; Features: Automotive AEC-Q200, Current Sense, Moisture Resistant, Pulse Withstanding; Height - Seated (Max): 0.069" (1.75mm); LastUpdated: 04/03/2022 18:20:41; Lifecycle Status: Active; Minimum Order: 1; Number of Terminations: 2; Operating Temperature: -65°C ~ 170°C; Packaging: TapeAndReel; PartId: 2683; Part Status: Active; Price: 0.90; Ratings: AEC-Q200; Resistance: 2 mOhms; Series: WSHP2818; Size / Dimension: 0.280" L x 0.181" W (7.10mm x 4.60mm); Supplier 1: DigiKey; Supplier Part Number 1: 541-3273-1-ND; Supplier Device Package: 2818; Tolerance: ±1%; Value: 2 mOhms
R14 R16-R19 = ERJ-PA3J102V: RES SMD 1K OHM 5% 1/4W 0603; Manufacturer: Panasonic Electronic Components; Power (Watts): 0.25W, 1/4W; Temperature Coefficient: ±200ppm/°C; Part Number: ERJ-PA3J102V; ComponentLink1Description: Datasheet; ComponentLink1URL: https://industrial.panasonic.com/cdbs/www-data/pdf/RDO0000/AOA0000C331.pdf; ComponentLink2Description: DigiKey Link; ComponentLink2URL: https://www.digikey.com/en/products/detail/panasonic-electronic-components/ERJ-PA3J102V/5035970; Composition: Thick Film; Device Package: 0603 (1608 Metric); Features: Automotive AEC-Q200, Pulse Withstanding; Height - Seated (Max): 0.022" (0.55mm); LastUpdated: 05/03/2022 17:04:10; Lifecycle Status: Active; Minimum Order: 1; Number of Terminations: 2; Operating Temperature: -55°C ~ 155°C; Package / Case: 0603 (1608 Metric); Packaging: TapeAndReel; PartId: 17507; Part Status: Active; Price: 0.01; Ratings: AEC-Q200; Resistance: 1 kOhms; Series: ERJ-PA3; Size / Dimension: 0.063" L x 0.031" W (1.60mm x 0.80mm); Supplier 1: DigiKey; Supplier Part Number 1: P1KBZCT-ND; Supplier Device Package: 0603; Tolerance: ±5%; Value: 1 kOhms
R15 = ERJ-PA3J121V: RES SMD 120 OHM 5% 1/4W 0603; Manufacturer: Panasonic Electronic Components; Power (Watts): 0.25W, 1/4W; Temperature Coefficient: ±200ppm/°C; Part Number: ERJ-PA3J121V; Value: 120 Ohms; ComponentLink1Description: Datasheet; ComponentLink1URL: https://industrial.panasonic.com/cdbs/www-data/pdf/RDO0000/AOA0000C331.pdf; ComponentLink2Description: DigiKey Link; ComponentLink2URL: https://www.digikey.com/en/products/detail/panasonic-electronic-components/ERJ-PA3J121V/5035980; Composition: Thick Film; Device Package: 0603 (1608 Metric); Features: Automotive AEC-Q200, Pulse Withstanding; Height - Seated (Max): 0.022" (0.55mm); LastUpdated: 05/03/2022 17:04:36; Lifecycle Status: Active; Minimum Order: 1; Number of Terminations: 2; Operating Temperature: -55°C ~ 155°C; Package / Case: 0603 (1608 Metric); Packaging: TapeAndReel; PartId: 8933; Part Status: Active; Price: 0.01; Ratings: AEC-Q200; Resistance: 120 Ohms; Series: ERJ-PA3; Size / Dimension: 0.063" L x 0.031" W (1.60mm x 0.80mm); Supplier 1: DigiKey; Supplier Part Number 1: P120BZCT-ND; Supplier Device Package: 0603; Tolerance: ±5%
S1 = SK-12F17-G 7: SWITCH SLIDE SPDT 300MA 30V; Manufacturer: C&K; Actuator Length: 7.00mm; Actuator Type: Standard; Contact Timing: Not Specified; Current Rating (Amps): 300mA (DC); Switch Function: On-On; Part Number: SK-12F17-G 7; Circuit: SPDT; ComponentLink1Description: Datasheet; ComponentLink1URL: //media.digikey.com/pdf/Data%20Sheets/C&K/SK-12F17-G.pdf; ComponentLink2Description: DigiKey Link; ComponentLink2URL: http://digikey.com/product-detail/en/c-k/SK-12F17-G-7/CKN10393-ND/2747163; Contact Finish: Silver; Contact Material: Copper; LastUpdated: 22/01/2022 09:16:27; Lifecycle Status: Active; Minimum Order: 1; Mounting Type: Through Hole, Right Angle; Packaging: Bulk; PartId: 3; Part Status: Active; Price: 0.55; Series: SK, COMAX; Supplier 1: DigiKey; Supplier Part Number 1: CKN10393-ND; Termination Style: PC Pin; Voltage Rating - DC: 30V
S2 S3 = FSM6JSMAASTR: SWITCH TACTILE SPST-NO 0.05A 24V; Manufacturer: TE Connectivity ALCOSWITCH Switches; Actuator Height off PCB, Vertical: 7.00mm; Actuator Orientation: Top Actuated; Actuator Type: Standard; Contact Rating @ Voltage: 0.05A @ 24VDC; Illumination: Non-Illuminated; Operating Force: 260gf; Outline: 6.00mm x 6.00mm; Switch Function: Off-Mom; Part Number: FSM6JSMAASTR; Circuit: SPST-NO; ComponentLink1Description: Datasheet; ComponentLink1URL: https://www.te.com/commerce/DocumentDelivery/DDEController?Action=srchrtrv&DocNm=1308111-1_SWITCHES_CORE_PROGRAM_CATALOG&DocType=CS&DocLang=English; ComponentLink2Description: DigiKey Link; ComponentLink2URL: https://www.digikey.com/en/products/detail/te-connectivity-alcoswitch-switches/FSM6JSMAASTR/5343804; LastUpdated: 05/03/2022 17:37:10; Lifecycle Status: Active; Minimum Order: 1; Mounting Type: Surface Mount; Operating Temperature: -40°C ~ 105°C; Packaging: TapeAndReel; Part Status: Active; Price: 0.30; Series: FSMJSMA; Supplier 1: DigiKey; Supplier Part Number 1: 450-2138-1-ND; Termination Style: Gull Wing